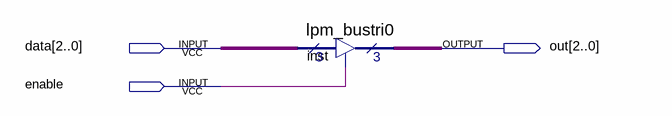
[diagram p0: schematic sheet]
// Quartus schematic slave.bdf as structural Verilog: 1 symbols, 3 pins
module slave (
  input  [2:0] data,
  input  enable,
  output [2:0] out
);

  lpm_bustri0 inst (.enabledt(enable), .data(data), .tridata(out));
endmodule
